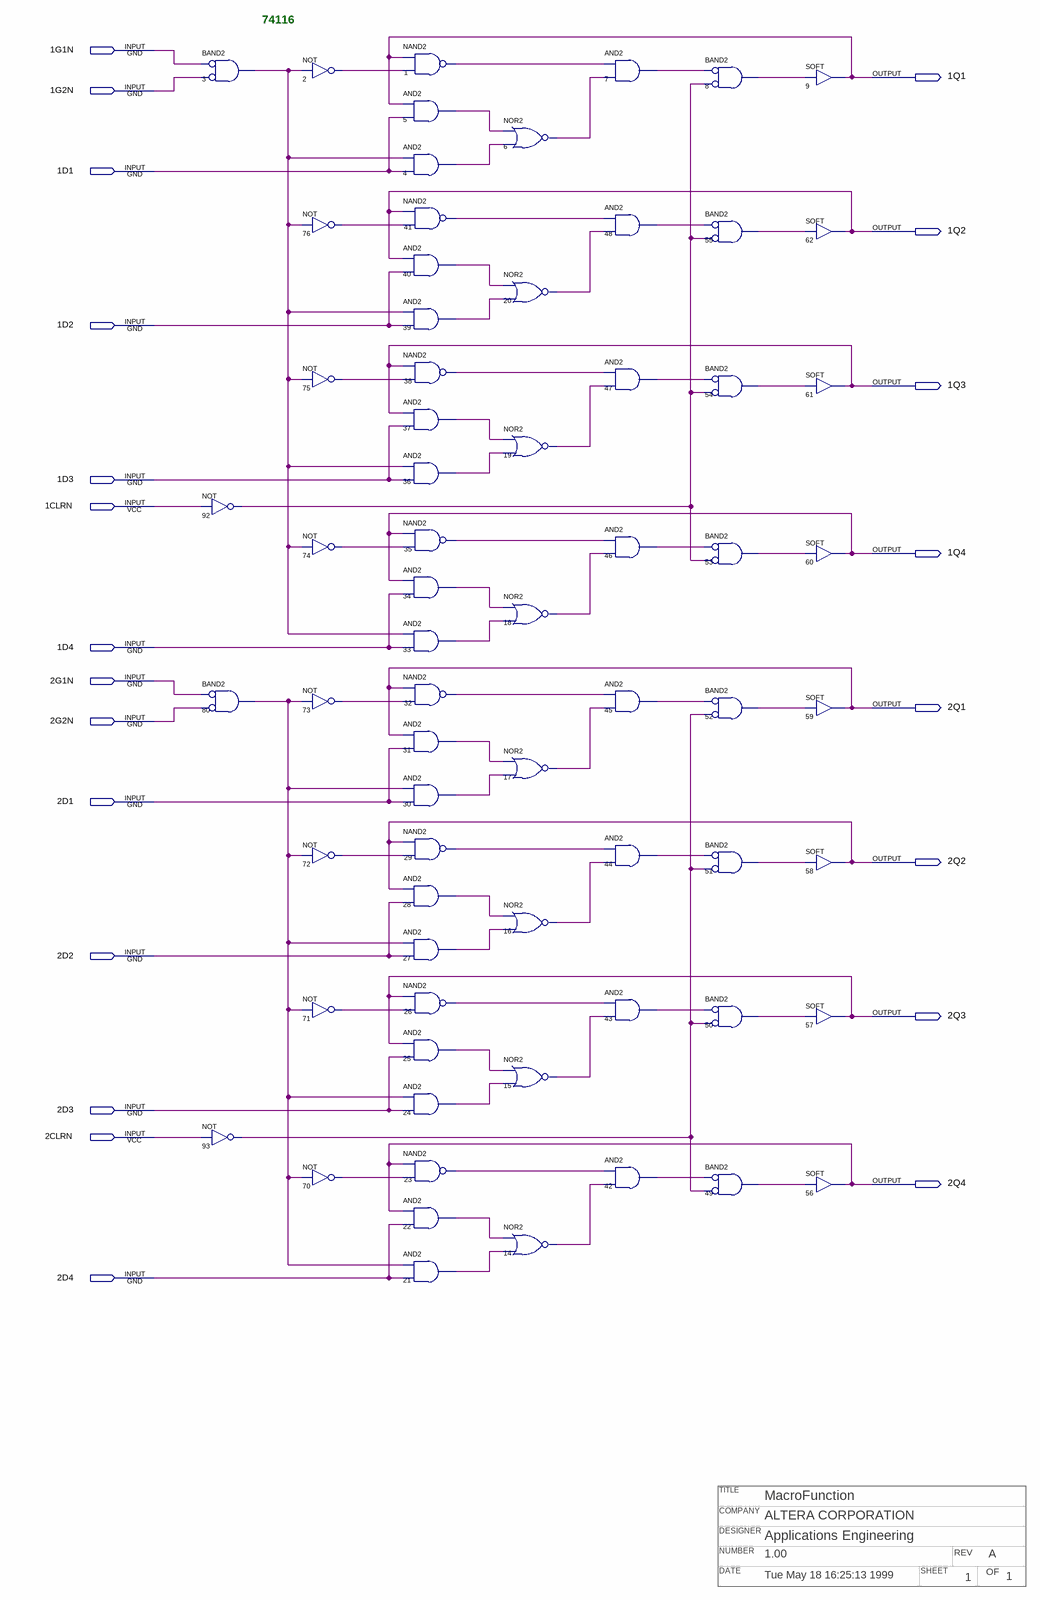
[diagram p0: schematic sheet]
// Quartus schematic 74116.bdf as structural Verilog: 68 symbols, 22 pins
// Title block: TITLE: MacroFunction; COMPANY: ALTERA CORPORATION; DESIGNER: Applications Engineering; NUMBER: 1.00; REV: A; DATE: Tue May 18 16:25:13 1999; SHEET: 1; OF: 1
module \74116  (
  input  \1G1N ,
  input  \1G2N ,
  input  \1D1 ,
  input  \1D2 ,
  input  \1D3 ,
  input  \1CLRN ,
  input  \1D4 ,
  input  \2G1N ,
  input  \2G2N ,
  input  \2D1 ,
  input  \2D2 ,
  input  \2D3 ,
  input  \2CLRN ,
  input  \2D4 ,
  output \1Q1 ,
  output \1Q2 ,
  output \1Q3 ,
  output \1Q4 ,
  output \2Q1 ,
  output \2Q2 ,
  output \2Q3 ,
  output \2Q4 
);

  wire n1_out, n2_out, n3_out, n4_out, n5_out, n6_out, n7_out, n8_out, n14_out, n15_out, n16_out, n17_out,
       n18_out, n19_out, n20_out, n21_out, n22_out, n23_out, n24_out, n25_out, n26_out, n27_out, n28_out,
       n29_out, n30_out, n31_out, n32_out, n33_out, n34_out, n35_out, n36_out, n37_out, n38_out, n39_out,
       n40_out, n41_out, n42_out, n43_out, n44_out, n45_out, n46_out, n47_out, n48_out, n49_out, n50_out,
       n51_out, n52_out, n53_out, n54_out, n55_out, n70_out, n71_out, n72_out, n73_out, n74_out, n75_out,
       n76_out, n80_out, n92_out, n93_out;

  and u_3 (n3_out, ~\1G1N , ~\1G2N );  // BAND2
  not u_92 (n92_out, \1CLRN );
  and u_80 (n80_out, ~\2G1N , ~\2G2N );  // BAND2
  not u_93 (n93_out, \2CLRN );
  not u_2 (n2_out, n3_out);
  not u_76 (n76_out, n3_out);
  not u_75 (n75_out, n3_out);
  not u_74 (n74_out, n3_out);
  not u_73 (n73_out, n80_out);
  not u_72 (n72_out, n80_out);
  not u_71 (n71_out, n80_out);
  not u_70 (n70_out, n80_out);
  nand u_1 (n1_out, \1Q1 , n2_out);
  and u_5 (n5_out, \1Q1 , \1D1 );
  and u_4 (n4_out, n3_out, \1D1 );
  nand u_41 (n41_out, \1Q2 , n76_out);
  and u_40 (n40_out, \1Q2 , \1D2 );
  and u_39 (n39_out, n3_out, \1D2 );
  nand u_38 (n38_out, \1Q3 , n75_out);
  and u_37 (n37_out, \1Q3 , \1D3 );
  and u_36 (n36_out, n3_out, \1D3 );
  nand u_35 (n35_out, \1Q4 , n74_out);
  and u_34 (n34_out, \1Q4 , \1D4 );
  and u_33 (n33_out, n3_out, \1D4 );
  nand u_32 (n32_out, \2Q1 , n73_out);
  and u_31 (n31_out, \2Q1 , \2D1 );
  and u_30 (n30_out, n80_out, \2D1 );
  nand u_29 (n29_out, \2Q2 , n72_out);
  and u_28 (n28_out, \2Q2 , \2D2 );
  and u_27 (n27_out, n80_out, \2D2 );
  nand u_26 (n26_out, \2Q3 , n71_out);
  and u_25 (n25_out, \2Q3 , \2D3 );
  and u_24 (n24_out, n80_out, \2D3 );
  nand u_23 (n23_out, \2Q4 , n70_out);
  and u_22 (n22_out, \2Q4 , \2D4 );
  and u_21 (n21_out, n80_out, \2D4 );
  nor u_6 (n6_out, n5_out, n4_out);
  nor u_20 (n20_out, n40_out, n39_out);
  nor u_19 (n19_out, n37_out, n36_out);
  nor u_18 (n18_out, n34_out, n33_out);
  nor u_17 (n17_out, n31_out, n30_out);
  nor u_16 (n16_out, n28_out, n27_out);
  nor u_15 (n15_out, n25_out, n24_out);
  nor u_14 (n14_out, n22_out, n21_out);
  and u_7 (n7_out, n1_out, n6_out);
  and u_48 (n48_out, n41_out, n20_out);
  and u_47 (n47_out, n38_out, n19_out);
  and u_46 (n46_out, n35_out, n18_out);
  and u_45 (n45_out, n32_out, n17_out);
  and u_44 (n44_out, n29_out, n16_out);
  and u_43 (n43_out, n26_out, n15_out);
  and u_42 (n42_out, n23_out, n14_out);
  and u_8 (n8_out, ~n7_out, ~n92_out);  // BAND2
  and u_55 (n55_out, ~n48_out, ~n92_out);  // BAND2
  and u_54 (n54_out, ~n47_out, ~n92_out);  // BAND2
  and u_53 (n53_out, ~n46_out, ~n92_out);  // BAND2
  and u_52 (n52_out, ~n45_out, ~n93_out);  // BAND2
  and u_51 (n51_out, ~n44_out, ~n93_out);  // BAND2
  and u_50 (n50_out, ~n43_out, ~n93_out);  // BAND2
  and u_49 (n49_out, ~n42_out, ~n93_out);  // BAND2
  SOFT u_9 (.IN(n8_out), .OUT(\1Q1 ));
  SOFT u_62 (.IN(n55_out), .OUT(\1Q2 ));
  SOFT u_61 (.IN(n54_out), .OUT(\1Q3 ));
  SOFT u_60 (.IN(n53_out), .OUT(\1Q4 ));
  SOFT u_59 (.IN(n52_out), .OUT(\2Q1 ));
  SOFT u_58 (.IN(n51_out), .OUT(\2Q2 ));
  SOFT u_57 (.IN(n50_out), .OUT(\2Q3 ));
  SOFT u_56 (.IN(n49_out), .OUT(\2Q4 ));

  // Notes on the sheet:
  //   74116
endmodule
